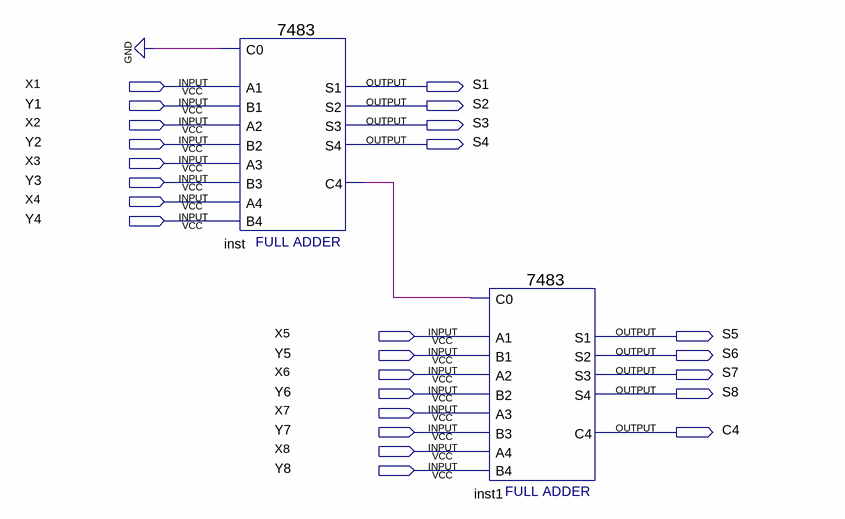
[diagram p0: schematic sheet]
// Quartus schematic 7483_8_bit.bdf as structural Verilog: 2 symbols, 25 pins
module \7483_8_bit  (
  input  X1,
  input  Y1,
  input  X2,
  input  Y2,
  input  X3,
  input  Y3,
  input  X4,
  input  Y4,
  input  X5,
  input  Y5,
  input  X6,
  input  Y6,
  input  X7,
  input  Y7,
  input  X8,
  input  Y8,
  output S1,
  output S2,
  output S3,
  output S4,
  output S5,
  output S6,
  output S7,
  output S8,
  output C4
);

  wire inst_c4;

  \7483  inst (
    .B4(Y4), .C0(1'b0), .A1(X1), .A2(X2), .B1(Y1), .B2(Y2), .A3(X3), .B3(Y3), .A4(X4), .S3(S3), .S4(S4),
    .S2(S2), .C4(inst_c4), .S1(S1));
  \7483  inst1 (
    .B4(Y8), .C0(inst_c4), .A1(X5), .A2(X6), .B1(Y5), .B2(Y6), .A3(X7), .B3(Y7), .A4(X8), .S3(S7), .S4(S8),
    .S2(S6), .C4(C4), .S1(S5));
endmodule
